# Altium schematic sheet 2026-09-05_04-21-311.schdoc
size 389 x 134 mm; SheetNumber: 1; SheetTotal: 1
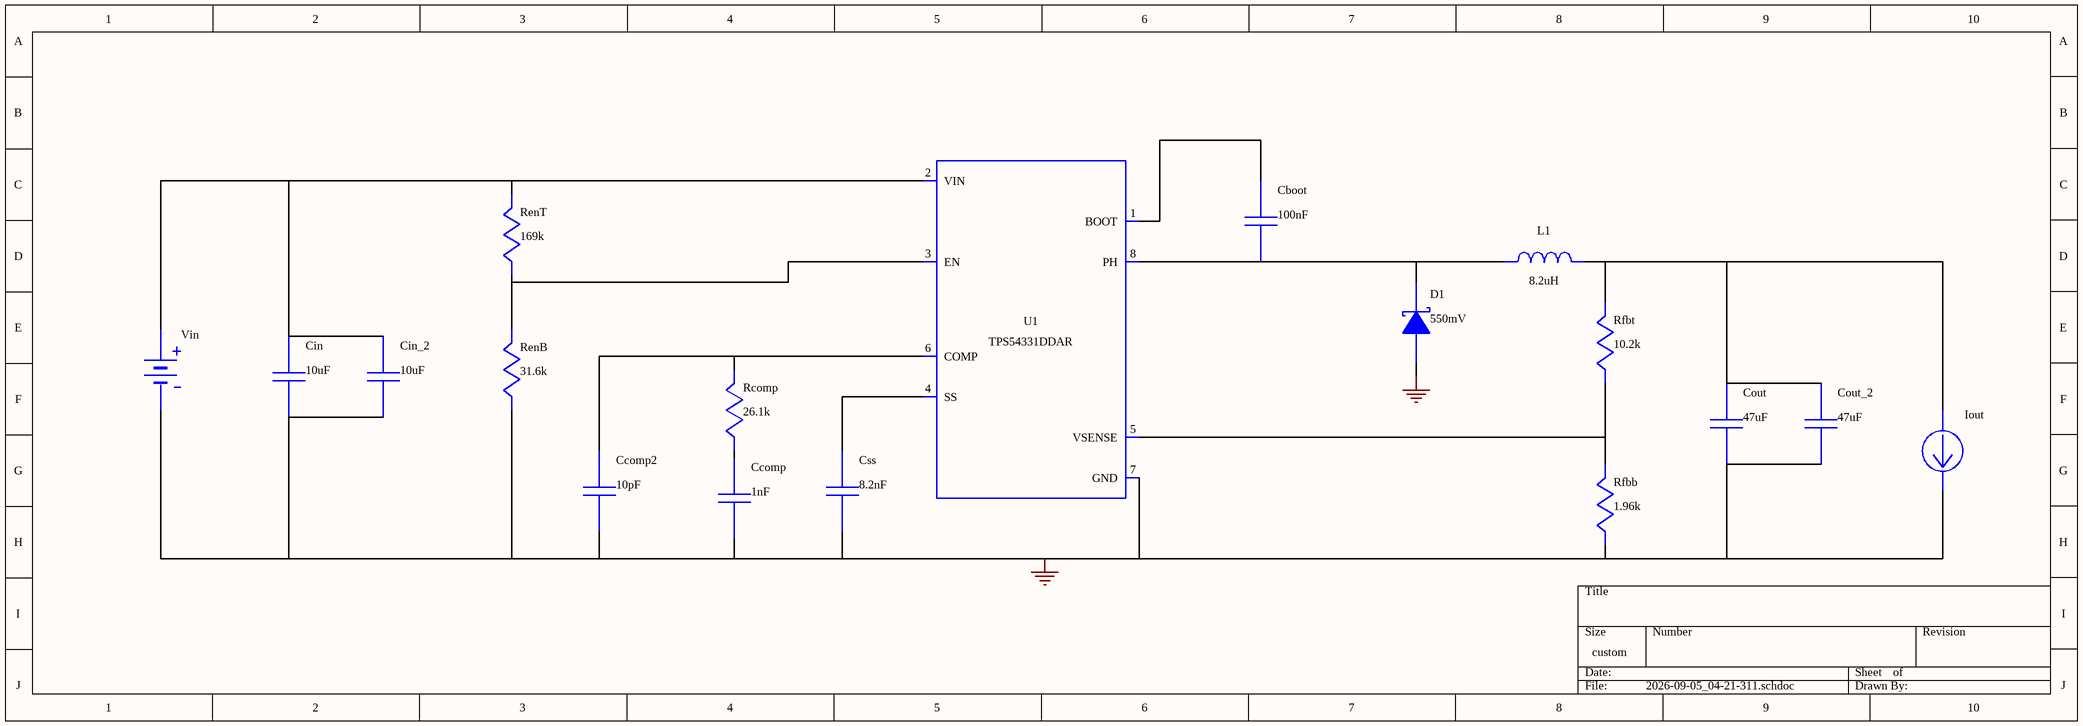
[diagram p0: 2026-09-05_04-21-311.schdoc]

## Parts
Cboot  value 100nF  (hidden comment: 08053C104KAT2A)
Ccomp  value 1nF  (hidden comment: GRM1555C1H102JA01J)
Ccomp2  value 10pF  (hidden comment: CC0805JRNPO9BN100)
Cin  value 10uF  (hidden comment: C3225X7R1H106M250AC)
Cin_2  value 10uF  (hidden comment: C3225X7R1H106M250AC)
Cout  value 47uF  (hidden comment: GRM32ER61C476KE15L)
Cout_2  value 47uF  (hidden comment: GRM32ER61C476KE15L)
Css  value 8.2nF  (hidden comment: GRM033R71A822KA01D)
D1  value 550mV  (hidden comment: B540C-13-F)
Iout  WB_CURRENT_LOAD  (value not drawn)
L1  value 8.2uH  (hidden comment: IHLP2525CZER8R2M01)
Rcomp  value 26.1k  (hidden comment: CRCW040226K1FKED)
RenB  value 31.6k  (hidden comment: CRCW040231K6FKED)
RenT  value 169k  (hidden comment: CRCW0402169KFKED)
Rfbb  value 1.96k  (hidden comment: CRCW04021K96FKED)
Rfbt  value 10.2k  (hidden comment: CRCW040210K2FKED)
U1  TPS54331DDAR
Vin  WB_BATTERY  (value not drawn)

## Nets
0: Ccomp.2 Ccomp2.2 Cin.2 Cin_2.2 Cout.2 Cout_2.2 Css.2 D1.2(A) Iout.2(-) RenB.2 Rfbb.2 U1.7(GND) U1.9(ETPAD) Vin.2(-)
NetCboot_1: Cboot.1 U1.1(BOOT)
NetCboot_2: Cboot.2 D1.1(K) L1.2 U1.8(PH)
NetCcomp2_1: Ccomp2.1 Rcomp.1 U1.6(COMP)
NetCcomp_1: Ccomp.1 Rcomp.2
NetCin_1: Cin.1 Cin_2.1 RenT.1 U1.2(VIN) Vin.1(+)
NetCout_1: Cout.1 Cout_2.1 Iout.1(+) L1.1 Rfbt.1
NetCss_1: Css.1 U1.4(SS)
NetRenB_1: RenB.1 RenT.2 U1.3(EN)
NetRfbb_1: Rfbb.1 Rfbt.2 U1.5(VSENSE)

## Library data of the parts
Cboot = 08053C104KAT2A: Manufacturer Name: AVX; PackageReference: 08053C104KAT2A; Manufacturer Part Number: 08053C104KAT2A
Ccomp = GRM1555C1H102JA01J: GRM1555C1H102JA0; Manufacturer Name: MuRata; PackageReference: GRM1555C1H102JA01J; Manufacturer Part Number: GRM1555C1H102JA01J
Ccomp2 = CC0805JRNPO9BN100: CC0805JRNPO9BN10; Manufacturer Name: Yageo; PackageReference: CC0805JRNPO9BN100; Manufacturer Part Number: CC0805JRNPO9BN100
Cin Cin_2 = C3225X7R1H106M250AC: C3225X7R1H106M25; Manufacturer Name: TDK; PackageReference: C3225X7R1H106M250AC; Manufacturer Part Number: C3225X7R1H106M250AC
Cout Cout_2 = GRM32ER61C476KE15L: GRM32ER61C476KE1; Manufacturer Name: MuRata; PackageReference: GRM32ER61C476KE15L; Manufacturer Part Number: GRM32ER61C476KE15L
Css = GRM033R71A822KA01D: GRM033R71A822KA0; Manufacturer Name: MuRata; PackageReference: GRM033R71A822KA01D; Manufacturer Part Number: GRM033R71A822KA01D
D1 = B540C-13-F: Manufacturer Name: Diodes Inc.; PackageReference: B540C-13-F; Manufacturer Part Number: B540C-13-F
L1 = IHLP2525CZER8R2M01: IHLP2525CZER8R2M; Manufacturer Name: Vishay-Dale; PackageReference: IHLP2525CZER8R2M01; Manufacturer Part Number: IHLP2525CZER8R2M01
Rcomp = CRCW040226K1FKED: Manufacturer Name: Vishay-Dale; PackageReference: CRCW040226K1FKED; Manufacturer Part Number: CRCW040226K1FKED
RenB = CRCW040231K6FKED: Manufacturer Name: Vishay-Dale; PackageReference: CRCW040231K6FKED; Manufacturer Part Number: CRCW040231K6FKED
RenT = CRCW0402169KFKED: Manufacturer Name: Vishay-Dale; PackageReference: CRCW0402169KFKED; Manufacturer Part Number: CRCW0402169KFKED
Rfbb = CRCW04021K96FKED: Manufacturer Name: Vishay-Dale; PackageReference: CRCW04021K96FKED; Manufacturer Part Number: CRCW04021K96FKED
Rfbt = CRCW040210K2FKED: Manufacturer Name: Vishay-Dale; PackageReference: CRCW040210K2FKED; Manufacturer Part Number: CRCW040210K2FKED
U1 = TPS54331DDAR: Manufacturer Name: Texas Instruments; PackageReference: TPS54331DDAR; Manufacturer Part Number: TPS54331DDAR; Value: N/A
Iout = WB_CURRENT_LOAD: PackageReference: WB_CURRENT_LOAD; Manufacturer Part Number: WB_CURRENT_LOAD; Manufacturer Name: WB_CURRENT_LOAD; Value: N/A
Vin = WB_BATTERY: PackageReference: WB_BATTERY; Manufacturer Part Number: WB_BATTERY; Manufacturer Name: WB_BATTERY; Value: N/A